# Altium schematic sheet [13] - HMI.SchDoc: HMI
size B; Organization: Altium Limited; Address1: L3, 12a Rodborough Rd; Address2: Frenchs Forest; Address3: NSW; Address4: Australia 2086; DocumentNumber: 13; Revision: V1I1; SheetNumber: 13; SheetTotal: 16
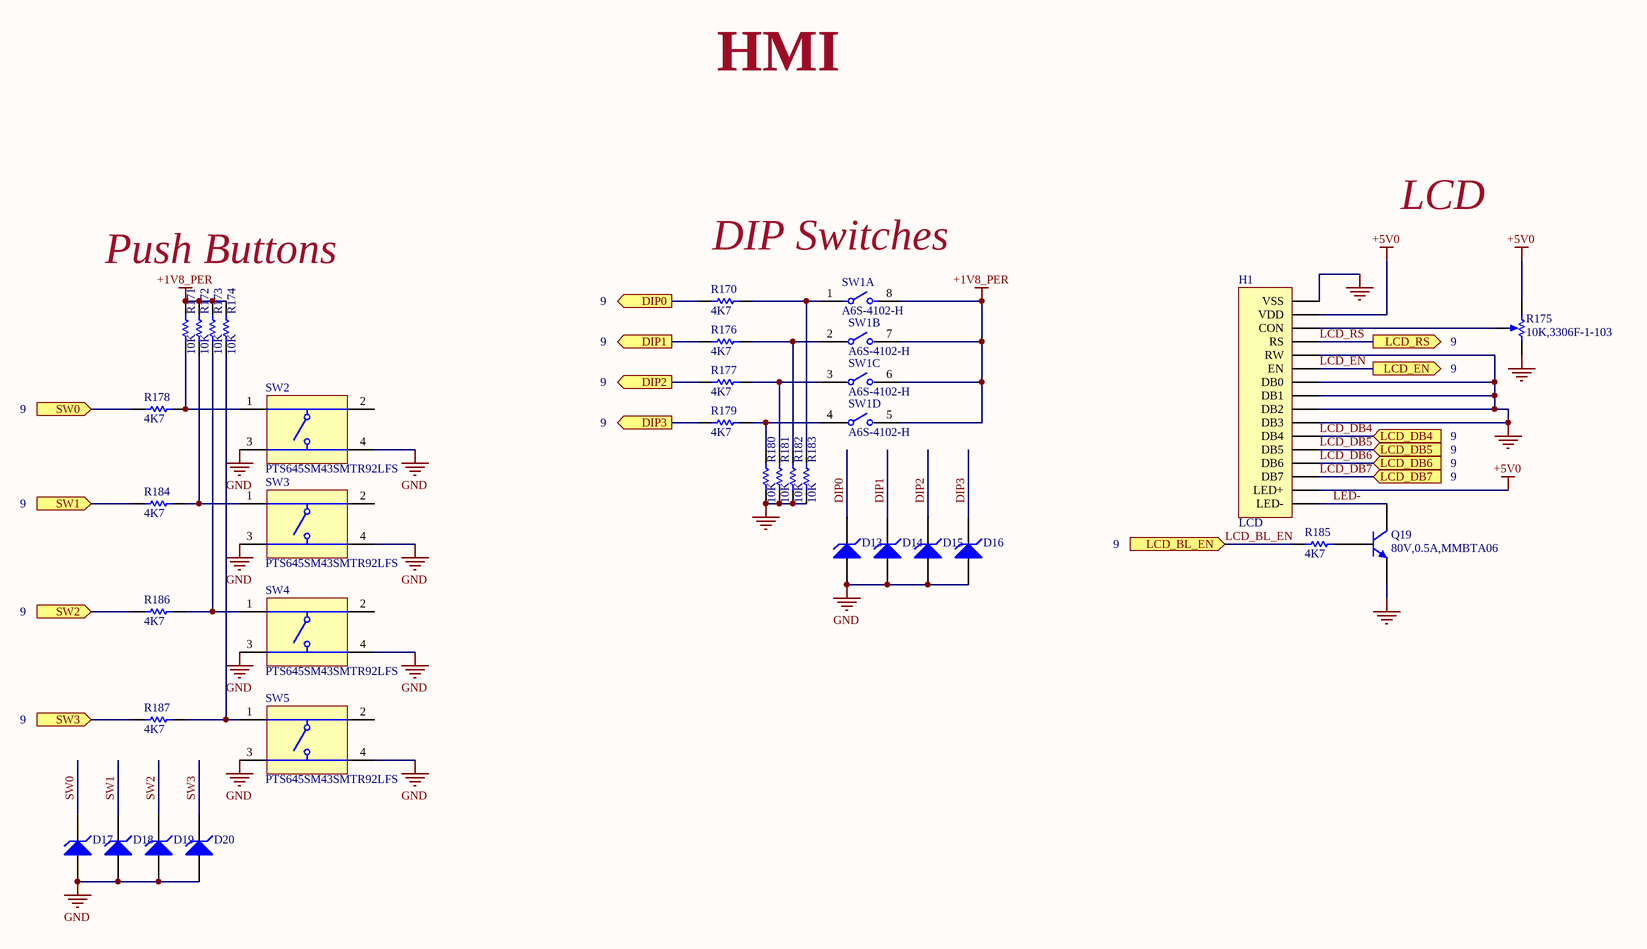
[diagram p0: [13] - HMI.SchDoc]

## Parts
D13  ESD5Z2.5T1G  [ONSC-SOD-523-2-502-01_V]  (value not drawn)
D14  ESD5Z2.5T1G  [ONSC-SOD-523-2-502-01_V]  (value not drawn)
D15  ESD5Z2.5T1G  [ONSC-SOD-523-2-502-01_V]  (value not drawn)
D16  ESD5Z2.5T1G  [ONSC-SOD-523-2-502-01_V]  (value not drawn)
D17  ESD5Z2.5T1G  [ONSC-SOD-523-2-502-01_V]  (value not drawn)
D18  ESD5Z2.5T1G  [ONSC-SOD-523-2-502-01_V]  (value not drawn)
D19  ESD5Z2.5T1G  [ONSC-SOD-523-2-502-01_V]  (value not drawn)
D20  ESD5Z2.5T1G  [ONSC-SOD-523-2-502-01_V]  (value not drawn)
H1  LCD  [16POS 2.54MM, PREC016SFAN-RC]
Q19  80V,0.5A,MMBTA06  [ONSC-SOT-23-3-318-08_V]
R170  Resistance: 4K7  (hidden comment: 4K7 0402 1%)
R171  value 10K  [RESC1005X40X25ML05T10]  (hidden comment: CRCW040210K0FKEDHP)
R172  value 10K  [RESC1005X40X25ML05T10]  (hidden comment: CRCW040210K0FKEDHP)
R173  value 10K  [RESC1005X40X25ML05T10]  (hidden comment: CRCW040210K0FKEDHP)
R174  value 10K  [RESC1005X40X25ML05T10]  (hidden comment: CRCW040210K0FKEDHP)
R175  10K,3306F-1-103  [Pot, 3306F-1-103]
R176  Resistance: 4K7  (hidden comment: 4K7 0402 1%)
R177  Resistance: 4K7  (hidden comment: 4K7 0402 1%)
R178  Resistance: 4K7  (hidden comment: 4K7 0402 1%)
R179  Resistance: 4K7  (hidden comment: 4K7 0402 1%)
R180  value 10K  [RESC1005X40X25ML05T10]  (hidden comment: CRCW040210K0FKEDHP)
R181  value 10K  [RESC1005X40X25ML05T10]  (hidden comment: CRCW040210K0FKEDHP)
R182  value 10K  [RESC1005X40X25ML05T10]  (hidden comment: CRCW040210K0FKEDHP)
R183  value 10K  [RESC1005X40X25ML05T10]  (hidden comment: CRCW040210K0FKEDHP)
R184  Resistance: 4K7  (hidden comment: 4K7 0402 1%)
R185  4K7  [R0805]
R186  Resistance: 4K7  (hidden comment: 4K7 0402 1%)
R187  Resistance: 4K7  (hidden comment: 4K7 0402 1%)
SW1  A6S-4102-H  [FP-A6S-4102-H-MFG]  (parts A,B,C,D of 4)
SW2  PTS645SM43SMTR92LFS  [ITT-PTS645S-4_V]
SW3  PTS645SM43SMTR92LFS  [ITT-PTS645S-4_V]
SW4  PTS645SM43SMTR92LFS  [ITT-PTS645S-4_V]
SW5  PTS645SM43SMTR92LFS  [ITT-PTS645S-4_V]

## Ports
DIP0 (out), DIP1 (out), DIP2 (out), DIP3 (out), LCD_BL_EN (in), LCD_DB4 (in), LCD_DB5 (in), LCD_DB6 (in), LCD_DB7 (in), LCD_EN (out), LCD_RS (out), SW0 (in), SW1 (in), SW2 (in), SW3 (in)

## Nets
+1V8_PER: R171.2 R172.2 R173.2 R174.2 SW1.5 SW1.6 SW1.7 SW1.8
+5V0: H1.2(VDD) H1.15(LED+) R175.1(CCW)
GND: D13.2(A) D14.2(A) D15.2(A) D16.2(A) D17.2(A) D18.2(A) D19.2(A) D20.2(A) H1.1(VSS) H1.5(RW) H1.7(DB0) H1.8(DB1) H1.9(DB2) H1.10(DB3) Q19.2(E) R175.3(CW) R180.1 R181.1 R182.1 R183.1 SW2.3 SW2.4 SW3.3 SW3.4 SW4.3 SW4.4 SW5.3 SW5.4
DIP0: R170.2 ; port DIP0
DIP0: D13.1(K)  [a separate net that carries the same name]
DIP1: R176.2 ; port DIP1
DIP1: D14.1(K)  [a separate net that carries the same name]
DIP2: R177.2 ; port DIP2
DIP2: D15.1(K)  [a separate net that carries the same name]
DIP3: R179.2 ; port DIP3
DIP3: D16.1(K)  [a separate net that carries the same name]
LCD_BL_EN: R185.1 ; port LCD_BL_EN
LCD_DB4: H1.11(DB4) ; port LCD_DB4
LCD_DB5: H1.12(DB5) ; port LCD_DB5
LCD_DB6: H1.13(DB6) ; port LCD_DB6
LCD_DB7: H1.14(DB7) ; port LCD_DB7
LCD_EN: H1.6(EN) ; port LCD_EN
LCD_RS: H1.4(RS) ; port LCD_RS
LED-: H1.16(LED-) Q19.3(C)
SW0: R178.2 ; port SW0
SW0: D17.1(K)  [a separate net that carries the same name]
SW1: R184.2 ; port SW1
SW1: D18.1(K)  [a separate net that carries the same name]
SW2: R186.2 ; port SW2
SW2: D19.1(K)  [a separate net that carries the same name]
SW3: R187.2 ; port SW3
SW3: D20.1(K)  [a separate net that carries the same name]
NetH1_3: H1.3(CON) R175.2(TAP)
NetQ19_1: Q19.1(B) R185.2
NetR170_1: R170.1 R183.2 SW1.1
NetR171_1: R171.1 R178.1 SW2.1
NetR172_1: R172.1 R184.1 SW3.1
NetR173_1: R173.1 R186.1 SW4.1
NetR174_1: R174.1 R187.1 SW5.1
NetR176_1: R176.1 R182.2 SW1.2
NetR177_1: R177.1 R181.2 SW1.3
NetR179_1: R179.1 R180.2 SW1.4

Not connected (* = marked no-connect by the designer): SW2 2; SW3 2; SW4 2; SW5 2

## Notes on the sheet
- HMI
- Push Buttons
- DIP Switches
- LCD
- 9
- (near R175) 9
- Title
- Size:
- Date:
- B
- Number:
- Time:
- Revision:
- Sheet
- of
- Mathew Locoteta
- 85 Artist Lake Dr.
- Middle Island
- New York, 11953
- United States of America
- File:

## Library data of the parts
D13-D20 = CMP-1063-00103-1: Transient Voltage Suppressor, Micro-Packaged Diode for ESD Protection, 2-Pin SOD-523, Pb-Free, Tape and Reel; Manufacturer: On Semiconductor; Direction: Unidirectional; PPK Max (W): 120; V(BR) Min (V): 4; VRWM Max (V): 2.5; Number of Lines: 1; IR Max (uA): 6; ComponentLink3Description: Package Specification; Packing: Tape and Reel; ComponentLink2URL: http://www.onsemi.cn/pub_link/Collateral/ESD5Z2.5T1-D.PDF; ComponentLink3URL: http://www.onsemi.com/pub_link/Collateral/502-01.PDF; PackageReference: SOD-523-2-502-01; PartNumber: ESD5Z2.5T1G; Mounting Technology: Surface Mount; DatasheetVersion: Rev. 10; PackageVersion: Rev. E, 09/2010; RoHS: Pb-Free; ComponentLink1Description: Manufacturer URL; PackageDescription: 2-Pin SOD, Body 1.2 x 0.8 mm; ComponentLink2Description: Datasheet; ComponentLink1URL: http://www.onsemi.com/
H1 = 4X20_LCD_HEADER: LCD Header; Manufacturer: Sullins; Manufacturer Part Number: PREC016SFAN-RC; Number of Positions: 16; Connector Type: Male Pin; Pitch: 0.1inch; Supplier 1: Digi-Key; Stock 1: 2071; Pricing 1: 1=0.40000, 10=0.37600, 25=0.32240, 50=0.27420, 100=0.26340, 250=0.23656, 500=0.22580 (USD); RoHS: Yes; Mount: Through Hole; Color: Black; Contact Plating: Tin; Package Quantity: 1; Number of Rows: 1; Packaging: Bulk; Termination: Solder; Contact Mating Length: 0.318inch; ComponentLink1URL: https://datasheet.ciiva.com/740/xrxczzzsxxn-rc-st-11635-b-740949.pdf?src-supplier=Digi-Key; ComponentLink1Description: https://datasheet.ciiva.com/740/xrxczzzsxxn-rc-st-11635-b-740949.pdf?src-supplier=Digi-Key; Supplier Part Number 1: S1212EC-16-ND
Q19 = MMBTA06LT1G: TRANS NPN 80V 0.5A SOT23; Manufacturer: ON Semiconductor; Max Power Dissipation: 225mW; Number of Elements: 1; Frequency: 100MHz; Emitter Base Voltage (VEBO): 4V; Collector Emitter Saturation Voltage: 250mV; Max Collector Current: 500mA; Power Dissipation: 300mW; Element Configuration: Single; hFE Min: 100; Supplier 1: Digi-Key; Manufacturer Part Number: MMBTA06LT1G; Stock 1: 502614; Pricing 1: 1=0.19000, 10=0.17000, 100=0.09230, 500=0.05682, 1000=0.03874 (USD); RoHS: Yes; Case/Package: SOT-23-3; Number of Pins: 3; Contact Plating: Tin,Matte; Min Operating Temperature: -55°C; Max Operating Temperature: 150°C; Package Quantity: 1; Collector Emitter Voltage (VCEO): 80V; Packaging: Tape and Reel; Polarity: NPN; Collector Base Voltage (VCBO): 80V; Collector Emitter Breakdown Voltage: 80V; Transition Frequency: 100MHz; Max Breakdown Voltage: 80V; Max Frequency: 100MHz; Gain Bandwidth Product: 100MHz; Voltage Rating (DC): 80V; Current Rating: 500mA; Length: 0.119inch; Height: 0.04inch; Width: 0.055inch; Radiation Hardening: No; REACH SVHC: No SVHC; Lead Free: Lead Free; ComponentLink1URL: https://datasheet.ciiva.com/4722/mmbta05lt1-d-101659-4722113.pdf?src-supplier=Mouser; ComponentLink1Description: https://datasheet.ciiva.com/4722/mmbta05lt1-d-101659-4722113.pdf?src-supplier=Mouser; ComponentLink2URL: https://datasheet.ciiva.com/15139/getdatasheetpartid-137838-15139444.pdf?src-supplier=Verical; ComponentLink2Description: https://datasheet.ciiva.com/15139/getdatasheetpartid-137838-15139444.pdf?src-supplier=Verical; ComponentLink3URL: https://datasheet.ciiva.com/11197/mmbta05lt1-d-11197414.pdf?src-supplier=Avnet; ComponentLink3Description: https://datasheet.ciiva.com/11197/mmbta05lt1-d-11197414.pdf?src-supplier=Avnet; ComponentLink4URL: https://datasheet.ciiva.com/976/mmbta05lt1-d-976473.pdf?src-supplier=Digi-Key; ComponentLink4Description: https://datasheet.ciiva.com/976/mmbta05lt1-d-976473.pdf?src-supplier=Digi-Key; ComponentLink5URL: https://datasheet.ciiva.com/976/mmbta05lt1-d-976474.pdf?src-supplier=Digi-Key; ComponentLink5Description: https://datasheet.ciiva.com/976/mmbta05lt1-d-976474.pdf?src-supplier=Digi-Key; ComponentLink6URL: https://datasheet.ciiva.com/25998/mmbta05lt1-d-25998830.pdf?src-supplier=Avnet+Europe; ComponentLink6Description: https://datasheet.ciiva.com/25998/mmbta05lt1-d-25998830.pdf?src-supplier=Avnet+Europe; ComponentLink7URL: https://datasheet.ciiva.com/16465/mmbta05lt1-d-16465685.pdf?src-supplier=Future+Electronics; ComponentLink7Description: https://datasheet.ciiva.com/16465/mmbta05lt1-d-16465685.pdf?src-supplier=Future+Electronics; ComponentLink8URL: https://datasheet.ciiva.com/11198/mmbta05lt1-d-11198678.pdf?src-supplier=Avnet; ComponentLink8Description: https://datasheet.ciiva.com/11198/mmbta05lt1-d-11198678.pdf?src-supplier=Avnet; ComponentLink9URL: https://datasheet.ciiva.com/976/mmbta05lt1-d-976475.pdf?src-supplier=Digi-Key; ComponentLink9Description: https://datasheet.ciiva.com/976/mmbta05lt1-d-976475.pdf?src-supplier=Digi-Key; ComponentLink10URL: https://datasheet.ciiva.com/7972/mmbta05lt1-d-7972078.pdf?src-supplier=Element14; ComponentLink10Description: https://datasheet.ciiva.com/7972/mmbta05lt1-d-7972078.pdf?src-supplier=Element14; ComponentLink11URL: https://datasheet.ciiva.com/16478/mmbta05lt1-d-16478574.pdf?src-supplier=Avnet+Asia; ComponentLink11Description: https://datasheet.ciiva.com/16478/mmbta05lt1-d-16478574.pdf?src-supplier=Avnet+Asia; Supplier Part Number 1: MMBTA06LT1GOSCT-ND
R170 R176-R179 R184 R186 R187 = CRCW04024K70FKED: Resistor SMD 4.7 kOhm 0402 PU=10000 ST, CRCW04024K70FKED, Vishay; Power Rating: 63mW; Temperature Coefficient: 100ppm/°C; Voltage Rating: 50V; Supplier 1: Digi-Key; Manufacturer: Vishay; Manufacturer Part Number: CRCW04024K70FKED; RoHS: Yes; Category: Chip SMD Resistors; Stock 1: 575743; Pricing 1: 1=0.10000, 10=0.03500, 100=0.01410, 1000=0.00633, 2500=0.00550, 5000=0.00454 (USD); Mount: Surface Mount; Case/Package: 0402; Weight: 2.3E-05oz; Contact Plating: Tin; Case Code (Imperial): 0402; Case Code (Metric): 1005; Min Operating Temperature: -55°C; Max Operating Temperature: 155°C; Tolerance: 1%; Composition: Thick Film; Packaging: Tape and Reel; Package Quantity: 10; Termination: SMD/SMT; Military Standard: Not; Voltage Rating (DC): 50V; Number of Terminations: 2; Max Power Dissipation: 63mW; Features: Automotive AEC-Q200; Length: 1mm; Height: 0.35mm; Width: 0.5mm; Depth: 0.5mm; Radiation Hardening: No; Lead Free: Lead Free; REACH SVHC: Unknown; ComponentLink1URL: https://datasheet.ciiva.com/11808/0900766b80d98824-11808622.pdf?src-supplier=RSComponents; ComponentLink1Description: https://datasheet.ciiva.com/11808/0900766b80d98824-11808622.pdf?src-supplier=RSComponents; ComponentLink2URL: https://datasheet.ciiva.com/3256/dcrcwe3-3256597.pdf?src-supplier=Avnet; ComponentLink2Description: https://datasheet.ciiva.com/3256/dcrcwe3-3256597.pdf?src-supplier=Avnet; ComponentLink3URL: https://datasheet.ciiva.com/5550/dcrcwe3-109170-5550295.pdf?src-supplier=Mouser; ComponentLink3Description: https://datasheet.ciiva.com/5550/dcrcwe3-109170-5550295.pdf?src-supplier=Mouser; ComponentLink4URL: https://datasheet.ciiva.com/16764/70201119-16764281.pdf?src-supplier=Allied+Electronics; ComponentLink4Description: https://datasheet.ciiva.com/16764/70201119-16764281.pdf?src-supplier=Allied+Electronics; ComponentLink5URL: https://datasheet.ciiva.com/2463/dcrcwe3-2463034.pdf?src-supplier=Digi-Key; ComponentLink5Description: https://datasheet.ciiva.com/2463/dcrcwe3-2463034.pdf?src-supplier=Digi-Key; ComponentLink6URL: https://datasheet.ciiva.com/16881/dcrcwe3-16881690.pdf?src-supplier=Avnet+Europe; ComponentLink6Description: https://datasheet.ciiva.com/16881/dcrcwe3-16881690.pdf?src-supplier=Avnet+Europe; ComponentLink7URL: https://datasheet.ciiva.com/2463/dcrcwe3-2463035.pdf?src-supplier=Digi-Key; ComponentLink7Description: https://datasheet.ciiva.com/2463/dcrcwe3-2463035.pdf?src-supplier=Digi-Key; ComponentLink8URL: https://datasheet.ciiva.com/8079/1697337-8079643.pdf?src-supplier=Element14; ComponentLink8Description: https://datasheet.ciiva.com/8079/1697337-8079643.pdf?src-supplier=Element14; ComponentLink9URL: https://datasheet.ciiva.com/2463/dcrcwe3-2463036.pdf?src-supplier=Digi-Key; ComponentLink9Description: https://datasheet.ciiva.com/2463/dcrcwe3-2463036.pdf?src-supplier=Digi-Key; ComponentLink10URL: https://datasheet.ciiva.com/26316/fld-crcw-e3-data-en-26316654.pdf?src-supplier=Distrelec; ComponentLink10Description: https://datasheet.ciiva.com/26316/fld-crcw-e3-data-en-26316654.pdf?src-supplier=Distrelec; Supplier Part Number 1: 541-4.70KLCT-ND
R171-R174 R180-R183 = CMP-2002-03043-1: Manufacturer: Vishay Dale; Part Number: CRCW040210K0FKEDHP
R175 = 3306F-1-103: BOURNS   3306F-1-103   TRIMMER, 10K, 6MM; Voltage Rating (DC): 100V; Power Rating: 200mW; Resistance: 10kR; Tolerance: 25%; Temperature Coefficient: 250ppm/°C; Number of Turns: 1; Supplier 1: Digi-Key; Manufacturer: Bourns; Manufacturer Part Number: 3306F-1-103; Stock 1: 8643; Pricing 1: 1=0.43000, 10=0.40000, 25=0.36000, 50=0.34800, 100=0.33600, 250=0.31200, 500=0.28800, 1000=0.27000, 5000=0.20400 (USD); RoHS: Yes; Mount: Through Hole,PCB; Weight: 360mg; Color: Blue; Min Operating Temperature: -25°C; Max Operating Temperature: 100°C; Packaging: Bulk; Termination: Pin; Package Quantity: 200; Composition: Cermet; Military Standard: Not; Max Power Dissipation: 200mW; Diameter: 6.81mm; Length: 6.81mm; Height: 7.62mm; Depth: 8.1mm; Width: 6.81mm; Radiation Hardening: No; Lead Free: Lead Free; REACH SVHC: No SVHC; ComponentLink1URL: https://datasheet.ciiva.com/19482/2022027-19482163.pdf?src-supplier=Jameco; ComponentLink1Description: https://datasheet.ciiva.com/19482/2022027-19482163.pdf?src-supplier=Jameco; ComponentLink2URL: https://datasheet.ciiva.com/11832/0900766b80dbb841-11832473.pdf?src-supplier=RSComponents; ComponentLink2Description: https://datasheet.ciiva.com/11832/0900766b80dbb841-11832473.pdf?src-supplier=RSComponents; ComponentLink3URL: https://datasheet.ciiva.com/2156/3306-2156049.pdf?src-supplier=Digi-Key; ComponentLink3Description: https://datasheet.ciiva.com/2156/3306-2156049.pdf?src-supplier=Digi-Key; ComponentLink4URL: https://datasheet.ciiva.com/16714/70154382-16714822.pdf?src-supplier=Allied+Electronics; ComponentLink4Description: https://datasheet.ciiva.com/16714/70154382-16714822.pdf?src-supplier=Allied+Electronics; ComponentLink5URL: https://datasheet.ciiva.com/23643/1815113-23643834.pdf?src-supplier=Newark; ComponentLink5Description: https://datasheet.ciiva.com/23643/1815113-23643834.pdf?src-supplier=Newark; ComponentLink6URL: https://datasheet.ciiva.com/26820/getdatasheetpartid-134310-26820122.pdf?src-supplier=Verical; ComponentLink6Description: https://datasheet.ciiva.com/26820/getdatasheetpartid-134310-26820122.pdf?src-supplier=Verical; ComponentLink7URL: https://datasheet.ciiva.com/8089/3306-8089643.pdf?src-supplier=Avnet; ComponentLink7Description: https://datasheet.ciiva.com/8089/3306-8089643.pdf?src-supplier=Avnet; ComponentLink8URL: https://datasheet.ciiva.com/1477/1815113-1477389.pdf?src-supplier=Element14; ComponentLink8Description: https://datasheet.ciiva.com/1477/1815113-1477389.pdf?src-supplier=Element14; Supplier Part Number 1: 3306F-103-ND
R185 = RMCF0805FT4K70: RES SMD 4.7K OHM 1% 1/8W 0805; Manufacturer: Stackpole Electronics; Resistance: 4.7kR; Power Rating: 125mW; Temperature Coefficient: 100ppm/°C; Supplier 1: Digi-Key; Manufacturer Part Number: RMCF0805FT4K70; Stock 1: 233318; Pricing 1: 1=0.10000, 10=0.02700, 100=0.01090, 1000=0.00490, 2500=0.00425 (USD); RoHS: Yes; Mount: Surface Mount; Case/Package: 0805; Case Code (Metric): 2012; Case Code (Imperial): 0805; Contact Plating: Tin,Matte; Min Operating Temperature: -55°C; Max Operating Temperature: 155°C; Tolerance: 1%; Packaging: Tape and Reel; Composition: Thick Film; Number of Terminations: 2; Military Standard: Not; Max Power Dissipation: 125mW; Features: Automotive AEC-Q200; Length: 2mm; Height: 0.026inch; Width: 0.049inch; Depth: 1.25mm; Radiation Hardening: No; Lead Free: Lead Free; ComponentLink1URL: http://www.seielect.com/catalog/sei-rmc.pdf?src-supplier=Future+Electronics; ComponentLink1Description: http://www.seielect.com/catalog/sei-rmc.pdf?src-supplier=Future+Electronics; ComponentLink2URL: http://components.arrow.com/part/dataview/44988207S7163511N1174?src-supplier=Arrow; ComponentLink2Description: http://components.arrow.com/part/dataview/44988207S7163511N1174?src-supplier=Arrow; ComponentLink3URL: https://www.seielect.com/catalog/SEI-RMCF_RMCP.pdf?src-supplier=Avnet; ComponentLink3Description: https://www.seielect.com/catalog/SEI-RMCF_RMCP.pdf?src-supplier=Avnet; ComponentLink4URL: https://www.seielect.com/Catalog/SEI-RMCF_RMCP.pdf?src-supplier=Digi-Key; ComponentLink4Description: https://www.seielect.com/Catalog/SEI-RMCF_RMCP.pdf?src-supplier=Digi-Key; ComponentLink5URL: https://www.seielect.com/catalog/SEI-Packaging.pdf?src-supplier=Digi-Key; ComponentLink5Description: https://www.seielect.com/catalog/SEI-Packaging.pdf?src-supplier=Digi-Key; ComponentLink6URL: https://www.verical.com/server-webapp/html/getDatasheet?partID=409513&src-supplier=Verical; ComponentLink6Description: https://www.verical.com/server-webapp/html/getDatasheet?partID=409513&src-supplier=Verical; Supplier Part Number 1: RMCF0805FT4K70CT-ND
SW1 = CMP-08827-000002-1: SWITCH SLIDE DIP SPST 25MA 24V; Manufacturer: Omron; Standoff Height: 0.7mm; Number Of Circuits: 4; Electromechanical Life: 1000Cycles; Contact Resistance: 200mΩ; Description: Switch DIP OFF ON SPST 4 Recessed Slide 0.025A 24VDC Gull Wing 1000Cycles 2.54mm SMD Tube; Package: 0; Temperature: -20°C to +70°C; Ambient Temperature Range High: +70°C; ComponentLink2Description: Datasheet; Temperature Range Low: -20°C; Lead Free: Yes; Manufacturer Part Number: A6S-4102-H; Automotive: No; Octopart: https://octopart.com/a6s-4102-h-omron-1228983; Voltage Rating Dc: 24V; Height: 3.8mm; Temperature Range High: +70°C; ComponentLink2URL: https://omronfs.omron.com/en_US/ecb/products/pdf/en-a6s.pdf; Device Class L2: Switches; Category: Switch; Ambient Temperature Range Low: -20°C; Throw Configuration: SPST; Digikey Description: SWITCH SLIDE DIP SPST 25MA 24V; Mouser Description: DIP Switches / SIP Switches Flat with Seal Tape 4 Poles; RoHS: TRUE; Mount: Surface Mount; Device Class L3: DIP Switches; Contact Current Rating: 25mA; Device Class L1: Electromechanical
SW2-SW5 = CMP-2000-05160-1: 6 mm Tact Switche, SPST, NO, -20 to 60 degC, 4-Pin SMT, RoHS, Tape and Reel; Manufacturer: ITT Cannon; Manufacturer URL: http://www.ittcannon.com/; Datasheet Version: Feb-14; Datasheet URL: https://datasheet.ciiva.com/29903/getdatasheetpartid-786341-29903846.pdf